# Altium schematic sheet 4 Channel ADC.SchDoc
size A4
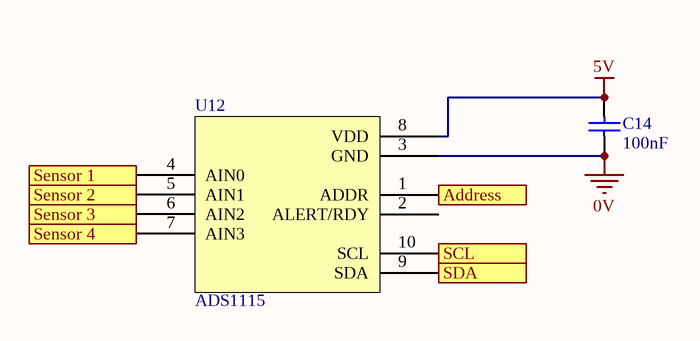
[diagram p0: 4 Channel ADC.SchDoc]

## Parts
C14  100nF  [0805]
U12  ADS1115  [TI 10-VSSOP]

## Ports
Address, SCL, SDA, Sensor 1, Sensor 2, Sensor 3, Sensor 4

## Nets
0V: C14.1 U12.3(GND)
5V: C14.2 U12.8(VDD)
Address: U12.1(ADDR) ; port Address
SCL: U12.10(SCL) ; port SCL
SDA: U12.9(SDA) ; port SDA
Sensor 1: U12.4(AIN0) ; port Sensor 1
Sensor 2: U12.5(AIN1) ; port Sensor 2
Sensor 3: U12.6(AIN2) ; port Sensor 3
Sensor 4: U12.7(AIN3) ; port Sensor 4

Not connected (* = marked no-connect by the designer): U12 2(ALERT/RDY)

## Library data of the parts
C14 = GCM21BR71E104KA37L: Manufacturer: muRata; Tolerance: 10%; Material: X7R; Rated Voltage: 25V; Part Number: GCM21BR71E104KA37L; Value: 100nF
U12 = ADS1115: 16 Bit Analog to Digital Converter 2, 4 Input 1 Sigma-Delta 10-VSSOP; Manufacturer: Texas Instruments; Part Number: ADS1115; Digikey Part Number: 296-38849-1-ND; Digikey Link: https://www.digikey.com/product-detail/en/texas-instruments/ADS1115IDGSR/296-38849-1-ND/5142969